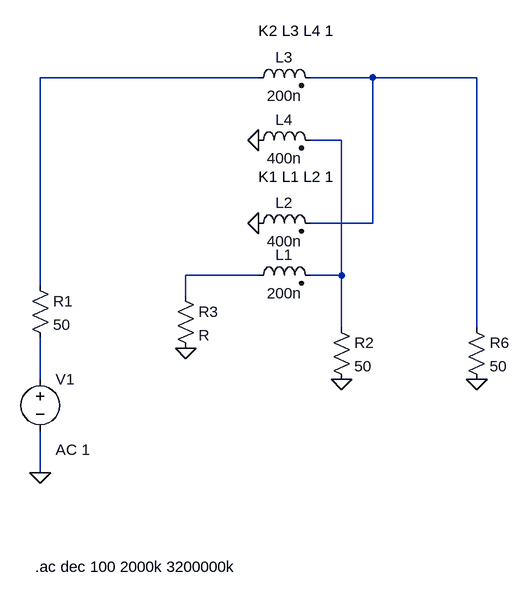
[diagram p0: schematic Draft2.asc]
Draft2.asc, the LTspice schematic file:
Version 4
SHEET 1 880 680
WIRE 416 -224 80 -224
WIRE 592 -224 496 -224
WIRE 752 -224 592 -224
WIRE 544 -128 496 -128
WIRE 592 0 592 -224
WIRE 592 0 496 0
WIRE 416 80 304 80
WIRE 544 80 544 -128
WIRE 544 80 496 80
WIRE 80 96 80 -224
WIRE 304 112 304 80
WIRE 544 160 544 80
WIRE 752 160 752 -224
WIRE 80 240 80 176
WIRE 80 384 80 320
FLAG 80 384 0
FLAG 752 240 0
FLAG 544 240 0
FLAG 304 192 0
FLAG 416 -128 0
FLAG 416 0 0
SYMBOL res 64 80 R0
SYMATTR InstName R1
SYMATTR Value 50
SYMBOL ind2 400 96 R270
WINDOW 0 32 56 VTop 2
WINDOW 3 4 56 VBottom 2
SYMATTR InstName L1
SYMATTR Value 200n
SYMATTR Type ind
SYMBOL ind2 400 16 R270
WINDOW 0 32 56 VTop 2
WINDOW 3 4 56 VBottom 2
SYMATTR InstName L2
SYMATTR Value 400n
SYMATTR Type ind
SYMBOL res 736 144 R0
SYMATTR InstName R6
SYMATTR Value 50
SYMBOL voltage 80 224 R0
WINDOW 123 24 124 Left 2
WINDOW 39 0 0 Left 2
SYMATTR InstName V1
SYMATTR Value ""
SYMATTR Value2 AC 1
SYMBOL ind2 400 -208 R270
WINDOW 0 32 56 VTop 2
WINDOW 3 4 56 VBottom 2
SYMATTR InstName L3
SYMATTR Value 200n
SYMATTR Type ind
SYMBOL ind2 400 -112 R270
WINDOW 0 32 56 VTop 2
WINDOW 3 4 56 VBottom 2
SYMATTR InstName L4
SYMATTR Value 400n
SYMATTR Type ind
SYMBOL res 528 144 R0
SYMATTR InstName R2
SYMATTR Value 50
SYMBOL res 288 96 R0
SYMATTR InstName R3
TEXT 416 -72 Left 2 !K1 L1 L2 1
TEXT 72 528 Left 2 !.ac dec 100 2000k 3200000k
TEXT 416 -296 Left 2 !K2 L3 L4 1

The netlist it stands for:
* Draft2.asc
R1 N001 N005 50
L1 N004 N003 200n
L2 0 N002 400n
R6 N002 0 50
V1 N005 0 AC 1
L3 N001 N002 200n
L4 0 N003 400n
R2 N003 0 50
R3 N004 0 R
K1 L1 L2 1
.ac dec 100 2000k 3200000k
K2 L3 L4 1
.backanno
.end